# Altium project 1438-5100-Puit de courant.PrjPcb
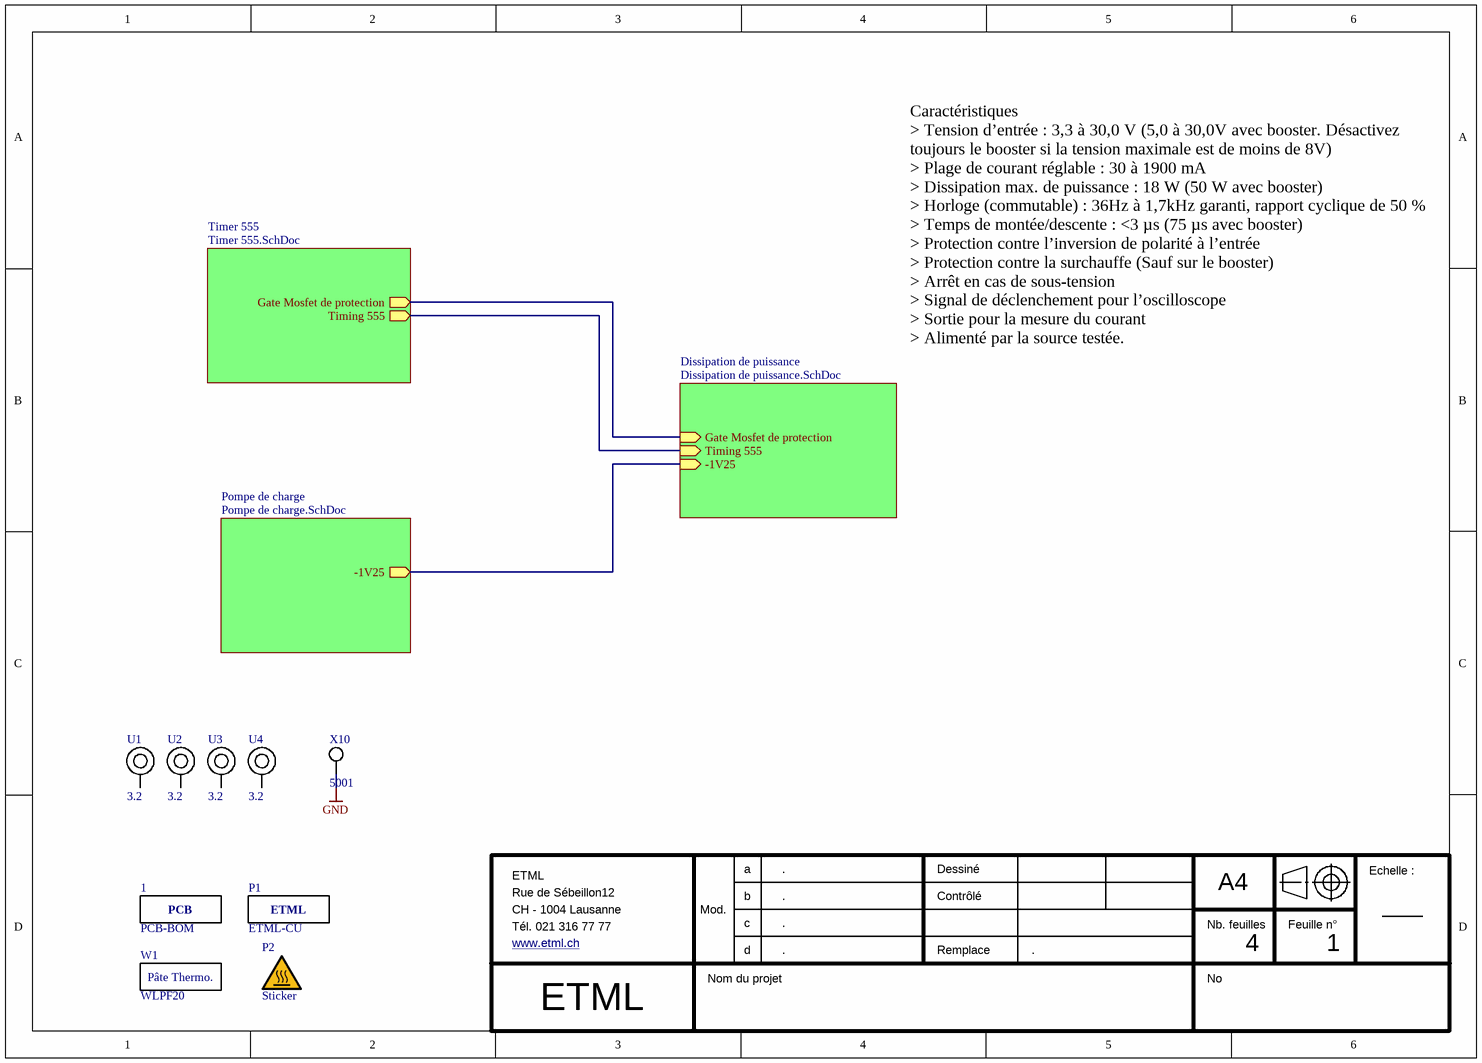
[diagram p0: Schéma bloc.SchDoc]
AsyNumber: 1438.5000.00; BomCheckedBy: -; BomCheckedDate: -; BomDrawnBy: AVR; BomDrawnDate: 2024-03-08; BomNumber: 1438.5600.00; BomTitle: Puit de courant; PcbCheckedBy: -; PcbCheckedDate: -; PcbDrawnBy: AVR; PcbDrawnDate: 2024-03-25; PcbNumber: 1438.5100.00; PcbTitle: Puit de courant; SchCheckedBy: -; SchCheckedDate: -; SchDrawnBy: AVR; SchDrawnDate: 2024-03-08; SchNumber: 1438.5200.00; SchTitle: Puit de courant
4 sheets, 101 parts. Net scope: hierarchical (ports join the sheet entries above them; power ports are global).
Board file: ETML_A4_2L.PcbDoc
Sheets:
  Schéma bloc.SchDoc
    Timer 555 = Timer 555.SchDoc
    Dissipation de puissance = Dissipation de puissance.SchDoc
    Pompe de charge = Pompe de charge.SchDoc

## Sheet Schéma bloc.SchDoc: =SchTitle
size 276 x 198 mm; Date: 2024-03-08; CheckedBy: -; DrawnBy: AVR; Organization: ETML; Address1: Rue de Sébeillon12; Address2: CH - 1004 Lausanne; Address3: Tél. 021 316 77 77; Address4: www.etml.ch; DocumentNumber: 1438.5200.00; SheetNumber: 1; SheetTotal: 4; CheckingDate: -; Replace: .; ModA: .; ModB: .; ModC: .; ModD: .

### Parts
1  PCB-BOM  (mechanical)
P1  ETML-CU  [DRAW-ETML-CU]  (no BOM)
P2  Sticker  [Sticker surface chaude]
U1  3.2  [MECH-PHD320]  (no BOM)
U2  3.2  [MECH-PHD320]  (no BOM)
U3  3.2  [MECH-PHD320]  (no BOM)
U4  3.2  [MECH-PHD320]  (no BOM)
W1  WLPF20
X10  5001  [Keystone_5001]

### Sub-sheets
Dissipation de puissance = Dissipation de puissance.SchDoc: Gate Mosfet de protection (in), Timing 555 (in), -1V25 (in)
Pompe de charge = Pompe de charge.SchDoc: -1V25 (out)
Timer 555 = Timer 555.SchDoc: Gate Mosfet de protection (out), Timing 555 (out)

### Nets
GND: X10.1(TP)
NetC5_2: sheet Dissipation de puissance/-1V25, sheet Pompe de charge/-1V25
NetK4_3: sheet Timer 555/Timing 555, sheet Dissipation de puissance/Timing 555
NetK5_1: sheet Timer 555/Gate Mosfet de protection, sheet Dissipation de puissance/Gate Mosfet de protection

Not connected (* = marked no-connect by the designer): U1 1(PH); U2 1(PH); U3 1(PH); U4 1(PH)

### Notes on the sheet
- Caractéristiques
  > Tension d’entrée : 3,3 à 30,0 V (5,0 à 30,0V avec booster. Désactivez toujours le booster si la tension maximale est de moins de 8V)
  > Plage de courant réglable : 30 à 1900 mA
  > Dissipation max. de puissance : 18 W (50 W avec booster)
  > Horloge (commutable) : 36Hz à 1,7kHz garanti, rapport cyclique de 50 %
  > Temps de montée/descente : <3 µs (75 µs avec booster)
  > Protection contre l’inversion de polarité à l’entrée
  > Protection contre la surchauffe (Sauf sur le booster)
  > Arrêt en cas de sous-tension
  > Signal de déclenchement pour l’oscilloscope
  > Sortie pour la mesure du courant
  > Alimenté par la source testée.
- a
- Dessiné
- A4
- Echelle :
- Mod.
- b
- c
- d
- Contrôlé
- Remplace
- Nb. feuilles
- Feuille n°
- Nom du projet
- No
- (in symbol CMP-064-000000-1) ETML
- (in symbol CMP-064-000001-1) PCB
- (in symbol Graisse thermique) Pâte Thermo.

### Library data of the parts
1 = CMP-064-000001-1: PCB element for BOM; IsStocked: False; PN: PN-108075; Category: Others; SubCategory: Dessins; Supplier Price 1: 0; Supplier 1: Eurocircuits Sàrl; Value: PCB-BOM; Supplier Part Number 1: -
P1 = CMP-064-000000-1: Logo ETML; PN: PN-439033; IsStocked: False; Value: ETML-CU; SubCategory: Dessins; Category: Others
P2 = Sticker Surface chaude ISO7010: PIC W017-TRI 015-PE-SHEET/1; IsStocked: 1; PN: PIC W017-TRI 015-PE-SHEET/1; Supplier 1: Distrelec; Supplier Part Number 1: 302-20-433; Supplier Price 1: 0.246
U1-U4 = CMP-063-000019-1: Plated Hole  3.2mm; IsStocked: False; PN: PN-781782; SubCategory: Mecaniques; Value: 3.2; Category: Others
W1 = Graisse thermique: Pâte thermoconductrice 0.7W/mK 10ml WLPF20 Fischer elektronik; IsStocked: 1; PN: WLPF20; Supplier 1: ETML; Supplier Part Number 1: MAG 369.123; Supplier Price 1: 12.83
X10 = CMP-054-000003-1: TEST THT MINIATURE BK; Manufacturer: Keystone; PN: PN-688907; IsStocked: True; SubCategory: Testpoints; Supplier 1: ETML; Supplier Price 1: 0.26; Supplier Part Number 1: MAG.428.011; Category: Connectors; Manufacturer Number: 5001; Value: 5001

## Sheet Timer 555.SchDoc: =SchTitle
size 276 x 198 mm; Date: 2024-03-08; CheckedBy: -; DrawnBy: AVR; Organization: ETML; Address1: Rue de Sébeillon12; Address2: CH - 1004 Lausanne; Address3: Tél. 021 316 77 77; Address4: www.etml.ch; DocumentNumber: 1438.5200.00; SheetNumber: 3; SheetTotal: 4; CheckingDate: -; Replace: .; ModA: .; ModB: .; ModC: .; ModD: .
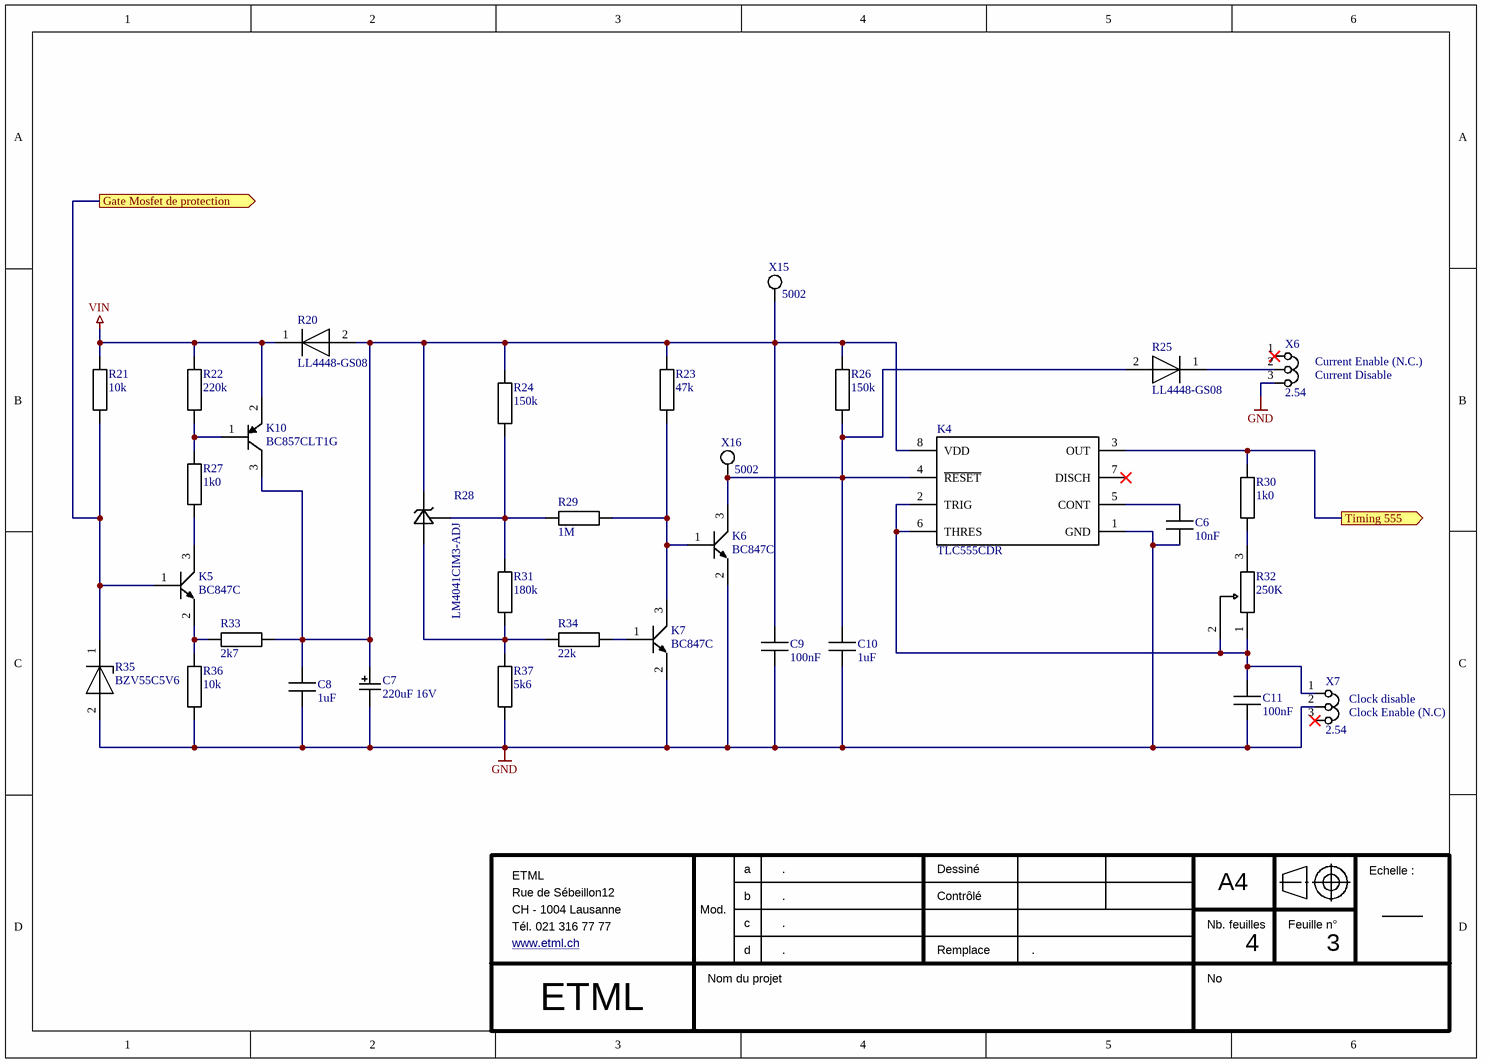
[diagram p1: Timer 555.SchDoc]

### Parts
C6  10nF  [CAPC1608X08M]
C7  220uF 16V  [NIC-CAPA2-6.3X7.7_V]
C8  1uF  [CAPC2012X08M]
C9  100nF  [CAPC2012X08M]
C10  1uF  [CAPC2012X08M]
C11  100nF  [CAPC2012X08M]
K4  TLC555CDR  [FP-D0008A-IPC_B]
K5  BC847C  [SOT90P240X110-3M]
K6  BC847C  [SOT90P240X110-3M]
K7  BC847C  [SOT90P240X110-3M]
K10  BC857CLT1G  [ONSC-SOT-23-3-318-08_V]
R20  LL4448-GS08  [FP-6_560-5005_01-4-MFG]
R21  10k  [RESC2012X06M]
R22  220k  [RESC2012X06M]
R23  47k  [RESC2012X06M]
R24  150k  [RESC2012X06M]
R25  LL4448-GS08  [FP-6_560-5005_01-4-MFG]
R26  150k  [RESC2012X06M]
R27  1k0  [RESC2012X06M]
R28  LM4041CIM3-ADJ  [DBZ0003A_M]
R29  1M  [RESC2012X06M]
R30  1k0  [RESC2012X06M]
R31  180k  [RESC2012X06M]
R32  250K  [FP-3296W-MFG]
R33  2k7  [RESC2012X06M]
R34  22k  [RESC2012X06M]
R35  BZV55C5V6  [FP-DO-213AA-MFG]
R36  10k  [RESC2012X06M]
R37  5k6  [RESC2012X06M]
X6  2.54  [PIN-1x03-2.54]
X7  2.54  [PIN-1x03-2.54]
X15  5002  [Keystone_5002]
X16  5002  [Keystone_5002]

### Ports
Gate Mosfet de protection (out), Timing 555 (out)

### Nets
GND: C6.1 C7.2 C8.1 C9.1 C10.1 C11.1 K4.1(GND) K6.2(Collector) K7.2(Collector) R35.2(A) R36.1 R37.1 X6.3 X7.2
VIN: K10.2(E) R20.1(C) R21.2 R22.2
NetC6_2: C6.2 K4.5(CONT)
NetC7_1: C7.1 C8.2 C9.2 K4.8(VDD) K10.3(C) R20.2(A) R23.2 R24.2 R26.2 R28.2(+V) R33.2 X15.1(TP)
NetC10_2: C10.2 K4.4(~{RESET}) K6.3(Emitter) R25.2(A) R26.1 X16.1(TP)
NetC11_2: C11.2 K4.2(TRIG) K4.6(THRES) R32.1(CCW) R32.2(WIPER) X7.1
NetK4_3: K4.3(OUT) R30.2 ; port Timing 555
NetK5_1: K5.1(Base) R21.1 R35.1(C) ; port Gate Mosfet de protection
NetK5_2: K5.2(Collector) R33.1 R36.2
NetK5_3: K5.3(Emitter) R27.1
NetK6_1: K6.1(Base) K7.3(Emitter) R23.1 R29.1
NetK7_1: K7.1(Base) R34.2
NetK10_1: K10.1(B) R22.1 R27.2
NetR24_1: R24.1 R28.1(FB) R29.2 R31.2
NetR25_1: R25.1(C) X6.2
NetR28_3: R28.3(-V) R31.1 R34.1 R37.2
NetR30_1: R30.1 R32.3(CW)

Not connected (* = marked no-connect by the designer): K4 7(DISCH)*; X6 1(0)*; X7 3*

### Notes on the sheet
- (near X6) Current Enable (N.C.)
- (near X6) Current Disable
- (near X7) Clock disable
- (near X7) Clock Enable (N.C)
- a
- Dessiné
- A4
- Echelle :
- Mod.
- b
- c
- d
- Contrôlé
- Remplace
- Nb. feuilles
- Feuille n°
- Nom du projet
- No

### Library data of the parts
C6 = CMP-065-000010-2: CAPC 10nF X7R 50V 10% 1608 (0603 INCH); Manufacturer: TDK; Manufacturer Number: C1608X7R1H103K080AA; TemperatureRange: -55°C to +125°C; IsStocked: 1; PN: PN-514948; Category: Passives; Voltage: 50V; Supplier 1: ETML; Supplier Part Number 1: FAB.0603_C 10nF; Tolerance: ±10%; SubCategory: Condensateurs ceramique; Dielectric: X7R; Supplier Price 1: 0.0123; Value: 10nF
C7 = CMP-0687-00060-1: Aluminum Electrolytic Capacitor,  220 uF, 16 V, + / - 20%,  6.3 x 7.7 mm D x L; PartNumber: UUD1C221MCL1GS; Manufacturer: Nichicon; Impedance: 0.34 Ohm; Tolerance Rated Capacitance: -20 to 20%; Endurance Time: 2000 h; Rated Ripple Current (at 100kHz): 280 mA; Packing: Dia382mm Reel; IsStocked: 1; PackageReference: CAPAE-D6.3H7.7; DatasheetVersion: 08/2012; Rated Voltage: 16 V; Rated Capacitance: 220 uF; ComponentLink1URL: http://www.nichicon.co.jp/; ComponentLink3URL: http://products.nichicon.co.jp/en/pdf/XJA043/e-ud.pdf; PackageDescription: 2-Pin Surface Mount Device, Diameter 6.3 mm, Height 7.7 mm, Pitch 5.4 mm; ComponentLink3Description: Package Specification; Length: 7.7 mm; RoHS: TRUE; Mounting Technology: Surface Mount; ComponentLink2Description: Datasheet; ComponentLink2URL: http://products.nichicon.co.jp/en/pdf/XJA043/e-ud.pdf; Diameter: 6.3 mm; ComponentLink1Description: Manufacturer URL; PN: UUD1C221MCL1GS; Supplier 1: Mouser; Supplier Part Number 1: 647-UUD1C221MCL; Supplier Price 1: 0.354
C8 C10 = CMP-065-000041-2: CAPC 1uF X5R 25V 10% 2012 (0805 INCH); Manufacturer: TDK; Manufacturer Number: KGM21AR51E105KU; Value: 1µF; TemperatureRange: -55°C to +85°C; IsStocked: 1; Supplier 1: Mouser; Category: Passives; Supplier Part Number 1: 581-KGM21AR51E105KU; SubCategory: Condensateurs ceramique; Tolerance: ±10%; Supplier Price 1: 1; Dielectric: X5R; Voltage: 25V; PN: KGM21AR51E105KU
C9 C11 = CMP-065-000038-2: CAPC 100nF X7R 50V 10% 2012 (0805 INCH); Manufacturer Number: C2012X7R1H104K085AA; Manufacturer: TDK; IsStocked: 1; TemperatureRange: -55°C to +125°C; PN: KAM21AR81H104KU; Supplier Part Number 1: 581-KAM21AR81H104KU; Supplier Price 1: 0.259; Voltage: 50V; Dielectric: X7R; Value: 100nF; SubCategory: Condensateurs ceramique; Category: Passives; Tolerance: ±10%; Supplier 1: Mouser
K4 = CMP-04857-000001-1: IC OSC SGL TIMER 2.1MHZ 8-SOIC; Min Supply Voltage: 2V; Number of Channels: 1; Max Power Dissipation: 725mW; Max Supply Voltage: 15V; Low Level Output Current: 100mA; Current Rating: 250A; Quiescent Current: 250uA; Operating Supply Current: 360uA; High Level Output Current: -10mA; Width: 3.91mm; Case/Package: SOIC; Weight: 0.002561oz; Frequency: 2.1MHz; Height: 1.58mm; Package Quantity: 2500; REACH SVHC: No SVHC; Number of Timers/Counters: 1; Lead Free: Lead Free; Number of Pins: 8; Max Operating Temperature: 125°C; Min Operating Temperature: -40°C; Length: 4.9mm; Radiation Hardening: No; Packaging: Tape and Reel; Termination: SMD/SMT; Mount: Surface Mount; Power Dissipation: 725mW; PN: TLC555CDR; Supplier 1: Mouser; Supplier Part Number 1: 595-TLC555CDR; Supplier Price 1: 0.553; IsStocked: 1
K5-K7 = BC847C: NPN general purpose transistor; IsStocked: 1; PN: BC847C; Supplier 1: Mouser; Supplier Part Number 1: 637-BC847C; Supplier Price 1: 0.086
K10 = CMP-1048-00802-1: General Purpose Transistor, PNP Silicon, 3-Pin SOT-23, Pb-Free, Tape and Reel, BC857CLT1G; Manufacturer: On Semiconductor; IC Continuous (A): -0.1; fT Min (MHz): 100; IsStocked: 1; Polarity: PNP; PackageReference: SOT-23-3-318-08; ComponentLink3Description: Package Specification; ComponentLink2Description: Datasheet; PackageDescription: 3-Pin Small Outline Transistor, Body 2.92 x 1.3 mm, Pitch 0.95 mm; PackageVersion: Rev. AP, 11/2009; ComponentLink1Description: Manufacturer URL; PartNumber: BC857CLT1G; ComponentLink2URL: http://www.onsemi.cn/pub_link/Collateral/BC856ALT1-D.PDF; ComponentLink1URL: http://www.onsemi.com/; ComponentLink3URL: http://www.onsemi.cn/pub_link/Collateral/318-08.PDF; RoHS: TRUE; Packing: Tape and Reel; Mounting Technology: Surface Mount; DatasheetVersion: Rev. 13; PN: BC857CLT1G; Supplier Part Number 1: 863-BC857CLT1G; Supplier 1: Mouser; Supplier Price 1: 0.086
R20 R25 = CMP-249167-000001-1: DIODE GEN PURP 75V 150MA SOD80; Manufacturer: Vishay Small Signal; Max Junction Temp: +175°C; Automotive Grade: Grade 0; Capacitance: 4pF; Peak Reverse Current: 5uA; Forward Current: 300mA; Max Repetitive Reverse Voltage: 100V; Max Surge Forward Current: 2A; Value: 4pF; IsStocked: 1; ComponentLink2Description: Datasheet; Height: 1.6mm; ComponentLink2URL: http://www.vishay.com/docs/85557/ll4148.pdf; Category: Diode; Lead Free: Yes; Device Class L3: Rectifier Diodes; Reverse Voltage: 75V; Mouser Description: Diodes - General Purpose, Power, Switching 100 Volt 100mA; RoHS: TRUE; Temperature: to +175°C; Automotive: Yes; Octopart: https://octopart.com/ll4448-gs08-vishay+small+signal-40886; Digikey Description: DIODE GEN PURP 75V 150MA SOD80; Manufacturer Part Number: LL4448-GS08; Temperature Range High: +175°C; Device Class L1: Discrete Semiconductors; Device Class L2: Diodes; Package: 6.560-5005.01-4; PN: LL4448-GS08; Supplier 1: Mouser; Supplier Part Number 1: 78-LL4448; Supplier Price 1: 0.139
R21 R36 = CMP-066-000199-2: RES 10kohm  ±1% 0.125W 2012 (0805 INCH); Manufacturer Number: RC0805FR-0710KL; Manufacturer: Yageo; PN: PN-374909; TemperatureCoeff: ±200ppm/°C; Voltage: 150V; TemperatureRange: -55°C to 155°C; IsStocked: 1; Tolerance: ±1%; Category: Passives; Value: 10k; Supplier Price 1: 0.0200; Supplier Part Number 1: FAB.0805_R 10k; Supplier 1: ETML; SubCategory: Resistances couche epaisse; Power: 0.125W
R22 = CMP-066-000215-2: RES 220kohm  ±1% 0.125W 2012 (0805 INCH); Manufacturer Number: RC0805FR-07220KL; Manufacturer: Yageo; PN: PN-479575; IsStocked: 1; TemperatureCoeff: ±200ppm/°C; Voltage: 150V; TemperatureRange: -55°C to 155°C; Value: 220k; Power: 0.125W; Tolerance: ±1%; Supplier Price 1: 0.0200; SubCategory: Resistances couche epaisse; Supplier 1: ETML; Category: Passives; Supplier Part Number 1: FAB.0805_R 220k
R23 = CMP-066-000207-2: RES 47kohm  ±1% 0.125W 2012 (0805 INCH); Manufacturer Number: RC0805FR-0747KL; Manufacturer: Yageo; TemperatureRange: -55°C to 155°C; Voltage: 150V; IsStocked: 1; TemperatureCoeff: ±200ppm/°C; PN: PN-427242; Category: Passives; Supplier Price 1: 0.0200; Power: 0.125W; Supplier 1: ETML; Tolerance: ±1%; SubCategory: Resistances couche epaisse; Supplier Part Number 1: FAB.0805_R 47k; Value: 47k
R24 R26 = CMP-066-000213-2: RES 150kohm  ±1% 0.125W 2012 (0805 INCH); Manufacturer: Yageo; Manufacturer Number: RC0805FR-07150KL; Voltage: 150V; TemperatureRange: -55°C to 155°C; TemperatureCoeff: ±200ppm/°C; PN: PN-241492; IsStocked: 1; Tolerance: ±1%; Supplier Part Number 1: FAB.0805_R 150k; Power: 0.125W; Value: 150k; Supplier Price 1: 0.0200; Category: Passives; Supplier 1: ETML; SubCategory: Resistances couche epaisse
R27 R30 = CMP-066-000187-2: RES 1.0kohm  ±1% 0.125W 2012 (0805 INCH); Manufacturer: Yageo; Manufacturer Number: RC0805FR-071KL; Value: 1k; PN: PN-746409; TemperatureRange: -55°C to 155°C; IsStocked: 1; TemperatureCoeff: ±200ppm/°C; Voltage: 150V; Supplier 1: ETML; SubCategory: Resistances couche epaisse; Supplier Price 1: 0.0200; Supplier Part Number 1: FAB.0805_R 1k0; Category: Passives; Tolerance: ±1%; Power: 0.125W
R28 = CMP-0074-00726-3: Precision Micropower Shunt Voltage Reference, 3-pin SOT-23; Manufacturer: Texas Instruments; PowerWise: N; PackageTopMarking: RAC*XTT; CompType: Voltage Reference IC; PN: LM4041CIM3-ADJ/NOPB; IsStocked: 1; DatasheetVersion: Mar-2005; PackageDescription: Molded SOT-23, .115 x .051 x .037in Body, 3 Lead, .075 in Pitch; PackageReference: DBZ0003A; PinCount: 3; PackageVersion: revB, Mar-2003; ComponentLink1URL: http://www.ti.com/general/docs/lit/getliterature.tsp?genericPartNumber=LM4041-N&fileType=pdf; RevisionNote: Component URLs added; RoHS: N; ComponentLink1Description: Datasheet URL; Supplier 1: Mouser; Supplier Part Number 1: 926-M4041CIM3ADJNOPB; Supplier Price 1: 0.623
R29 = CMP-066-000223-2: RES 1.0Mohm  ±1% 0.125W 2012 (0805 INCH); Manufacturer: Yageo; Manufacturer Number: RC0805FR-071ML; IsStocked: 1; Voltage: 150V; TemperatureCoeff: ±200ppm/°C; TemperatureRange: -55°C to 155°C; PN: PN-531908; Tolerance: ±1%; Supplier Price 1: 0.0200; Power: 0.125W; Supplier 1: ETML; Category: Passives; Supplier Part Number 1: FAB.0805_R 1M; SubCategory: Resistances couche epaisse; Value: 1M
R31 = CMP-066-000214-2: RES 180kohm  ±1% 0.125W 2012 (0805 INCH); Manufacturer: Yageo; Manufacturer Number: RC0805FR-07180KL; TemperatureCoeff: ±200ppm/°C; Voltage: 150V; TemperatureRange: -55°C to 155°C; PN: PN-810533; IsStocked: 1; SubCategory: Resistances couche epaisse; Power: 0.125W; Supplier 1: ETML; Value: 180k; Supplier Part Number 1: FAB.0805_R 180k; Tolerance: ±1%; Supplier Price 1: 0.0200; Category: Passives
R32 = CMP-07234-000001-1: TRIMMER 250K OHM 0.5W PC PIN TOP; Manufacturer: Bourns; Manufacturer Part Number: 3296W-1-254LF; Value: 250kΩ; Standoff Height: 0.38mm; Temperature Coefficient: 100ppm/°C; Tolerance: 10%; Voltage Rating: 300V; IsStocked: 1; Category: Res; Octopart: https://octopart.com/3296w-1-254lf-bourns-574856; Device Class L2: Resistors; Mouser Description: Res Cermet Trimmer 250K Ohm 10% 1/2W 25(Elec)Turn 2.19mm (9.53 X 4.83 X 11.55mm) Pin Thru-Hole Tube; Temperature: -55°C to +125°C; Temperature Range Low: -55°C; ComponentLink2URL: https://www.bourns.com/data/global/pdfs/3296.pdf; Power Rating: 0.5W; Package: 3296W; Lead Free: Yes; Series: Trimpot 3296-Sealed; Height: 12.05mm; Device Class L1: Passive Components; Device Class L3: Variable Resistors and Potentiometers; ComponentLink2Description: Datasheet; Resistance: 250kΩ; Digikey Description: TRIMMER 250K OHM 0.5W PC PIN TOP; Automotive: No; RoHS: TRUE; Temperature Range High: +125°C; PN: 3296W-1-254LF; Supplier 1: Mouser; Supplier Part Number 1: 652-3296W-1-254LF; Supplier Price 1: 2.12
R33 = CMP-066-000192-2: RES 2.7kohm  ±1% 0.125W 2012 (0805 INCH); Manufacturer Number: RC0805FR-072K7L; Manufacturer: Yageo; Value: 2.7k; TemperatureRange: -55°C to 155°C; TemperatureCoeff: ±200ppm/°C; IsStocked: 1; PN: PN-891617; Voltage: 150V; Category: Passives; Supplier 1: ETML; SubCategory: Resistances couche epaisse; Supplier Part Number 1: FAB.0805_R 2k7; Power: 0.125W; Tolerance: ±1%; Supplier Price 1: 0.0200
R34 = CMP-066-000203-2: RES 22kohm  ±1% 0.125W 2012 (0805 INCH); Manufacturer: Yageo; Manufacturer Number: RC0805FR-0722KL; PN: PN-851075; Voltage: 150V; TemperatureCoeff: ±200ppm/°C; TemperatureRange: -55°C to 155°C; IsStocked: 1; Tolerance: ±1%; Supplier Part Number 1: FAB.0805_R 22k; SubCategory: Resistances couche epaisse; Value: 22k; Supplier Price 1: 0.0200; Supplier 1: ETML; Category: Passives; Power: 0.125W
R35 = CMP-00252-16640727-1: BZV55C5V6 Diode Zener Single 5.6V 2% 3.33mW 2-Pin MELF DO-213AA Bag; Test Current: 5mA; Voltage Tolerance: 7%; Min Operating Temperature: -65°C; RoHS: Non-Compliant; Element Configuration: Single; Number of Pins: 2; NexarPartId: 16640727; Zener Voltage: 5.6V; Lifecycle Status: Production; Mount: Surface Mount; Tolerance: 7%; Max Operating Temperature: 175°C; PN: BZV55C5V6; Supplier 1: Mouser; Supplier Part Number 1: 494-BZV55C5V6; Supplier Price 1: 2.53
R37 = CMP-066-000196-2: RES 5.6kohm  ±1% 0.125W 2012 (0805 INCH); Manufacturer: Yageo; Manufacturer Number: RC0805FR-075K6L; IsStocked: 1; PN: PN-467784; TemperatureRange: -55°C to 155°C; Value: 5.6k; Voltage: 150V; TemperatureCoeff: ±200ppm/°C; Power: 0.125W; Supplier Part Number 1: FAB.0805_R 5k6; Tolerance: ±1%; Supplier Price 1: 0.0200; Supplier 1: ETML; Category: Passives; SubCategory: Resistances couche epaisse
X6 X7 = CMP-054-000017-1: JUMPER 2.54 1x03; Manufacturer Number: 61303611121; Manufacturer: Würth Electronik; Current: 3A; IsStocked: True; PN: PN-771444; Voltage: 250VAC; TemperatureRange: -40°C to +105 °C; Supplier 1: ETML; Supplier Price 1: 0.06; Category: Connectors; SubCategory: Jumpers; Supplier Part Number 1: MAG.283.897; Value: 2.54
X15 X16 = CMP-054-000004-1: TEST THT MINIATURE WT; Manufacturer: Keystone; PN: PN-357949; IsStocked: True; Category: Connectors; Value: 5002; Supplier Part Number 1: MAG.428.013; Supplier 1: ETML; Supplier Price 1: 0.2931; SubCategory: Testpoints; Manufacturer Number: 5002

## Sheet Dissipation de puissance.SchDoc: =SchTitle
size 276 x 198 mm; Date: 2024-03-08; CheckedBy: -; DrawnBy: AVR; Organization: ETML; Address1: Rue de Sébeillon12; Address2: CH - 1004 Lausanne; Address3: Tél. 021 316 77 77; Address4: www.etml.ch; DocumentNumber: 1438.5200.00; SheetNumber: 2; SheetTotal: 4; CheckingDate: -; Replace: .; ModA: .; ModB: .; ModC: .; ModD: .
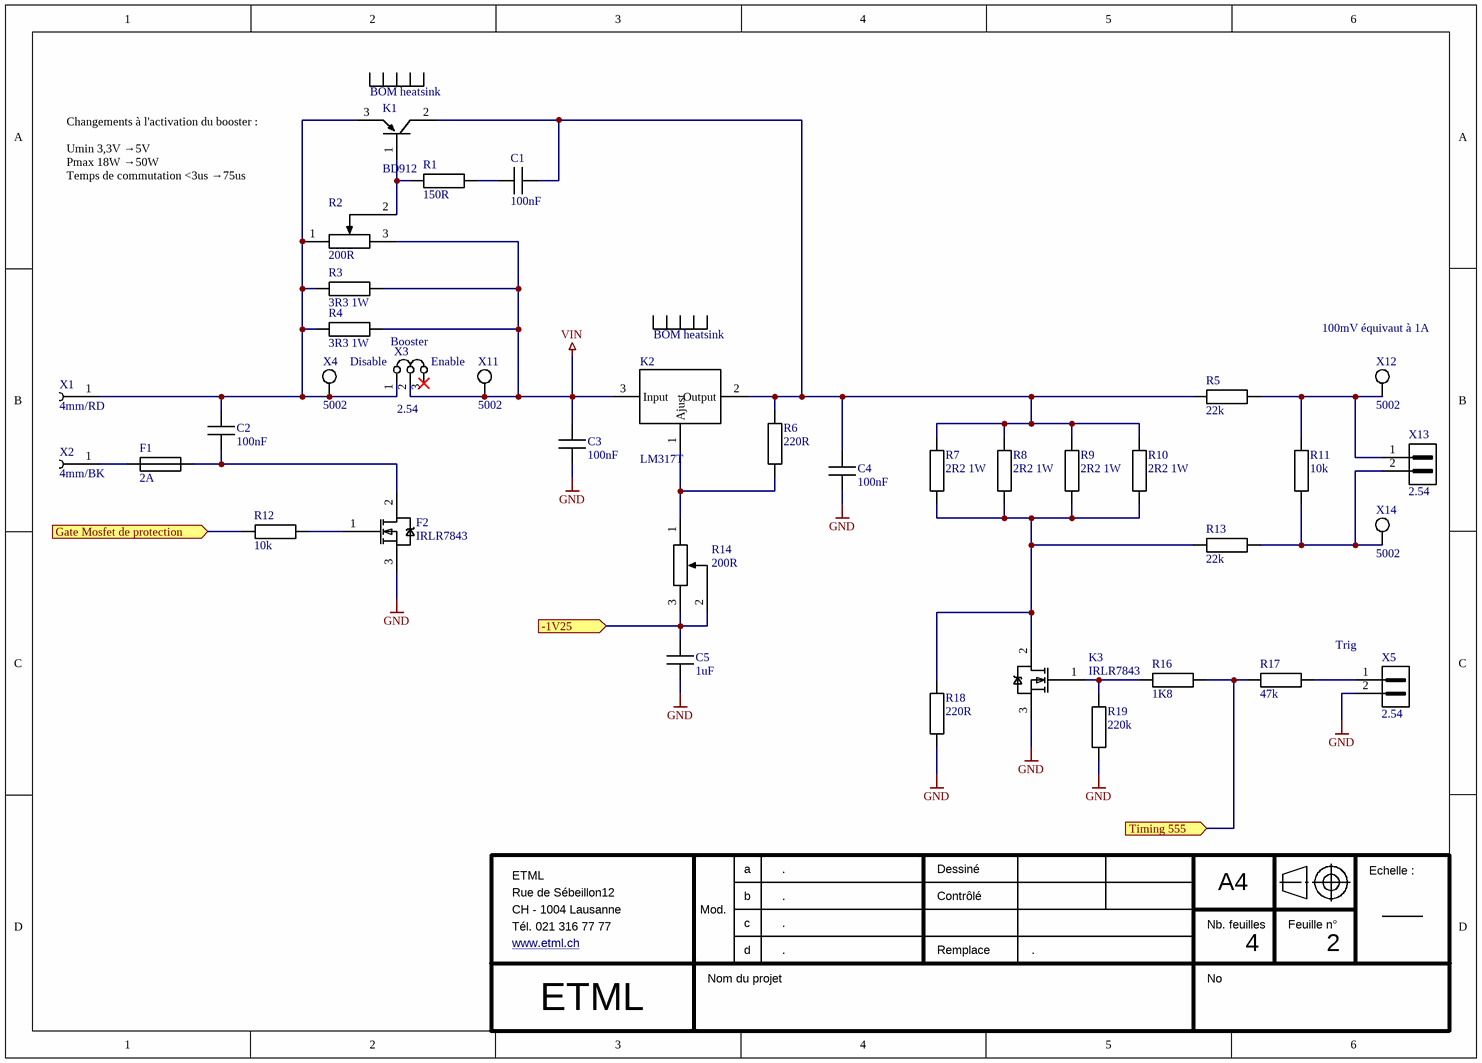
[diagram p2: Dissipation de puissance.SchDoc]

### Parts
C1  100nF  [CAPC2012X08M]
C2  100nF  [CAPC2012X08M]
C3  100nF  [CAPC2012X08M]
C4  100nF  [CAPC2012X08M]
C5  1uF  [CAPC2012X08M]
E1  WAKEFIELD THERMAL 678-39-C  [Designator]  (value not drawn)
E2  WAKEFIELD THERMAL 678-39-C  [Designator]  (value not drawn)
F1  2A  [WE_696103201002]
F2  IRLR7843  [DPAK228P991X238-3M]
K1  BD912  [TO220 With WAKEFIELD THERMAL 678-39-C]
K2  LM317T  [TO220 With WAKEFIELD THERMAL 678-39-C]
K3  IRLR7843  [DPAK228P991X238-3M]
R1  150R  [RESC2012X06M]
R2  200R  [FP-3296W-MFG]
R3  3R3 1W  [NEOHM 1W ROX1S]
R4  3R3 1W  [NEOHM 1W ROX1S]
R5  22k  [RESC2012X06M]
R6  220R  [RESC2012X06M]
R7  2R2 1W  [NEOHM 1W ROX1S]
R8  2R2 1W  [NEOHM 1W ROX1S]
R9  2R2 1W  [NEOHM 1W ROX1S]
R10  2R2 1W  [NEOHM 1W ROX1S]
R11  10k  [RESC2012X06M]
R12  10k  [RESC2012X06M]
R13  22k  [RESC2012X06M]
R14  200R  [FP-3296W-MFG]
R16  1K8  [RESC2012X06M]
R17  47k  [RESC2012X06M]
R18  220R  [RESC2012X06M]
R19  220k  [RESC2012X06M]
X1  4mm/RD  [SKS_973582101]
X2  4mm/BK  [SKS_973582100]
X3  2.54  [PIN-1x03-2.54]
X4  5002  [Keystone_5002]
X5  2.54  [PIN-1x02-2.54]
X11  5002  [Keystone_5002]
X12  5002  [Keystone_5002]
X13  2.54  [PIN-1x02-2.54]
X14  5002  [Keystone_5002]

### Ports
-1V25 (in), Gate Mosfet de protection (in), Timing 555 (in)

### Nets
GND: C3.1 C4.1 C5.1 F2.3(S) K3.3(S) R18.1 R19.1 X5.2
VIN: C3.2 K2.3(Input) R2.3 R3.2 R4.2 X3.2 X11.1(TP)
NetC1_1: C1.1 C4.2 K1.2(Collector) K2.2(Output) R5.1 R6.2 R7.2 R8.2 R9.2 R10.2
NetC1_2: C1.2 R1.2
NetC2_1: C2.1 F1.2 F2.2(D)
NetC2_2: C2.2 K1.3(Emitter) R2.1 R3.1 R4.1 X1.1 X3.1 X4.1(TP)
NetC5_2: C5.2 R14.2 R14.3 ; port -1V25
NetF1_1: F1.1 X2.1
NetF2_1: F2.1(G) R12.2
NetK1_1: K1.1(Base) R1.1 R2.2
NetK2_1: K2.1(Ajust) R6.1 R14.1
NetK3_1: K3.1(G) R16.1 R19.2
NetK3_2: K3.2(D) R7.1 R8.1 R9.1 R10.1 R13.1 R18.2
NetK4_3: R16.2 R17.1 ; port Timing 555
NetK5_1: R12.1 ; port Gate Mosfet de protection
NetR5_2: R5.2 R11.2 X12.1(TP) X13.1
NetR11_1: R11.1 R13.2 X13.2 X14.1(TP)
NetR17_2: R17.2 X5.1

Not connected (* = marked no-connect by the designer): X3 3*

### Notes on the sheet
- Changements à l'activation du booster :
  Umin 3,3V →5V
  Pmax 18W →50W
  Temps de commutation <3us →75us
- (near X12) 100mV équivaut à 1A
- (near X3) Disable
- Booster
- (near X3) Enable
- Trig
- a
- Dessiné
- A4
- Echelle :
- Mod.
- b
- c
- d
- Contrôlé
- Remplace
- Nb. feuilles
- Feuille n°
- Nom du projet
- No
- (in symbol WAKEFIELD THERMAL 678-39-C) BOM heatsink

### Library data of the parts
C1-C4 = CMP-065-000038-2: as C9 on sheet Timer 555; Supplier Part Number 1: 581-KAM21AR81H104KU; Supplier Price 1: 0.259; Voltage: 50V; Dielectric: X7R; Value: 100nF; SubCategory: Condensateurs ceramique; Category: Passives; Tolerance: ±10%; Supplier 1: Mouser
C5 = CMP-065-000041-2: as C8 on sheet Timer 555; Supplier 1: Mouser; Category: Passives; Supplier Part Number 1: 581-KGM21AR51E105KU; SubCategory: Condensateurs ceramique; Tolerance: ±10%; Supplier Price 1: 1; Dielectric: X5R; Voltage: 25V; PN: KGM21AR51E105KU
E1 E2 = WAKEFIELD THERMAL 678-39-C: HEAT SINK, ALUMINIUM, TO-PACKAGE, SMD
F1 = CMP-067-000003-1: Fusible FST 2A temporisé; Manufacturer: Würth Electronik; Manufacturer Number: 696103201002; TemperatureRange: -30°C to +120°C; Voltage: 250VAC; PN: 261.476; Value: 5x20mm; IsStocked: True; Supplier Part Number 1: MAG 261.476; Current: 2A; SubCategory: Fusibles; Category: Protections; Supplier 1: ETML; Supplier Price 1: 0.33
F2 K3 = IRLR7843: N channel Mosfet
K1 = BD912: PNP transistor
K2 = LM317T: TO-220 ajustable votage regulator
R1 = CMP-066-000177-2: RES 150ohm  ±1% 0.125W 2012 (0805 INCH); Manufacturer: Yageo; Manufacturer Number: RC0805FR-07150RL; Value: 150; TemperatureRange: -55°C to 155°C; Voltage: 150V; TemperatureCoeff: ±200ppm/°C; PN: PN-455993; IsStocked: 1; Supplier Price 1: 0.0200; Tolerance: ±1%; SubCategory: Resistances couche epaisse; Power: 0.125W; Supplier Part Number 1: FAB.0805_R 150R; Supplier 1: ETML; Category: Passives
R2 R14 = CMP-066-000235-2: RESADJ 200ohm Cermet 25 turns; Manufacturer: Bourns Incorporated; Tolerance: ±10%; TemperatureCoeff: ±100ppm/°C; IsStocked: 1; PN: PN-614445; Power: 500mW; TemperatureRange: -55°C to +125°C; Supplier 1: Farnell; Category: Passives; Supplier Price 1: 3.36; Value: 200R; Supplier Part Number 1: 9353747; SubCategory: Resistances ajustables
R3 R4 = NEOHM - TE CONNECTIVITY ROX1SJ3R3: Résistance traversante, 3.3 ohm, ROX, 1 W, ± 5%, Axial, 350 V; Manufacturer Number: MRS25000C3308FCT00; Manufacturer: Vishay; PN: PN-918915; Voltage: 350V; Power: 0.6W; TemperatureRange: -55°C to 155°C; Value: 3.3; Tolerance: ±1%; IsStocked: 1; TemperatureCoeff: ±50ppm/°C; Supplier Price 1: 0.1500; SubCategory: Resistances film metallique; Category: Passives; Supplier 1: Farnell; Supplier 2: Mouser; Supplier 3: Digikey; Supplier Part Number 1: 3399704; Supplier Part Number 2: 279-ROX1SJ3R3; Supplier Part Number 3: A131468CT-ND
R5 R13 = CMP-066-000203-2: as R34 on sheet Timer 555; Tolerance: ±1%; Supplier Part Number 1: FAB.0805_R 22k; SubCategory: Resistances couche epaisse; Value: 22k; Supplier Price 1: 0.0200; Supplier 1: ETML; Category: Passives; Power: 0.125W
R6 R18 = CMP-066-000179-2: RES 220ohm  ±1% 0.125W 2012 (0805 INCH); Manufacturer: Yageo; Manufacturer Number: RC0805FR-07220RL; TemperatureRange: -55°C to 155°C; Voltage: 150V; IsStocked: 1; TemperatureCoeff: ±200ppm/°C; PN: PN-694076; Value: 220; SubCategory: Resistances couche epaisse; Supplier Price 1: 0.0200; Category: Passives; Supplier Part Number 1: FAB.0805_R 220R; Supplier 1: ETML; Tolerance: ±1%; Power: 0.125W
R7-R10 = NEOHM - TE CONNECTIVITY ROX1SJ2R2: Résistance traversante, 2.2 ohm, ROX, 1 W, ± 5%, Axial, 350 V; Manufacturer Number: MRS25000C3308FCT00; Manufacturer: Vishay; PN: PN-918915; Voltage: 350V; Power: 0.6W; TemperatureRange: -55°C to 155°C; Value: 2.2; Tolerance: ±1%; IsStocked: 1; TemperatureCoeff: ±50ppm/°C; Supplier Price 1: 0.1500; SubCategory: Resistances film metallique; Category: Passives; Supplier 1: Farnell; Supplier 2: Mouser; Supplier 3: Digikey; Supplier Part Number 1: 3399704; Supplier Part Number 2: 279-ROX1SJ3R3; Supplier Part Number 3: A131468CT-ND
R11 R12 = CMP-066-000199-2: as R21 on sheet Timer 555; Tolerance: ±1%; Category: Passives; Value: 10k; Supplier Price 1: 0.0200; Supplier Part Number 1: FAB.0805_R 10k; Supplier 1: ETML; SubCategory: Resistances couche epaisse; Power: 0.125W
R16 = CMP-066-000190-2: RES 1.8kohm  ±1% 0.125W 2012 (0805 INCH); Manufacturer Number: RC0805FR-071K8L; Manufacturer: Yageo; TemperatureRange: -55°C to 155°C; Voltage: 150V; IsStocked: 1; PN: PN-653534; TemperatureCoeff: ±200ppm/°C; Value: 1.8k; Power: 0.125W; Supplier Part Number 1: FAB.0805_R 1K8; Category: Passives; Tolerance: ±1%; Supplier Price 1: 0.0200; Supplier 1: ETML; SubCategory: Resistances couche epaisse
R17 = CMP-066-000207-2: as R23 on sheet Timer 555; Category: Passives; Supplier Price 1: 0.0200; Power: 0.125W; Supplier 1: ETML; Tolerance: ±1%; SubCategory: Resistances couche epaisse; Supplier Part Number 1: FAB.0805_R 47k; Value: 47k
R19 = CMP-066-000215-2: as R22 on sheet Timer 555; Value: 220k; Power: 0.125W; Tolerance: ±1%; Supplier Price 1: 0.0200; SubCategory: Resistances couche epaisse; Supplier 1: ETML; Category: Passives; Supplier Part Number 1: FAB.0805_R 220k
X1 = CMP-054-000001-1: Embase 4mm PCB 16A 60VDC Sn Red; Manufacturer: SKS Kontakttechnik GmbH; Manufacturer Number: 973582101; TemperatureRange: -25°C to +85°C; PN: PN-628499; Dielectric: PC; IsStocked: True; Value: 4mm/RD; Supplier Price 1: 1.7; Supplier 1: ETML; Current: 16A; Voltage: 60VDC; SubCategory: Laboratoire; Category: Connectors; Supplier Part Number 1: MAG.277.666
X2 = CMP-054-000000-1: Embase 4mm PCB 16A 60VDC Sn Black; Manufacturer: SKS Kontakttechnik GmbH; Manufacturer Number: 973582100; Dielectric: PC; TemperatureRange: -25°C to +85°C; IsStocked: True; PN: PN-390416; SubCategory: Laboratoire; Supplier 1: ETML; Supplier Price 1: 1.51; Value: 4mm/BK; Supplier Part Number 1: MAG.277.665; Voltage: 60VDC; Current: 16A; Category: Connectors
X3 = CMP-054-000017-1: as X6 on sheet Timer 555; Supplier 1: ETML; Supplier Price 1: 0.06; Category: Connectors; SubCategory: Jumpers; Supplier Part Number 1: MAG.283.897; Value: 2.54
X4 X11 X12 X14 = CMP-054-000004-1: as X15 on sheet Timer 555; Category: Connectors; Value: 5002; Supplier Part Number 1: MAG.428.013; Supplier 1: ETML; Supplier Price 1: 0.2931; SubCategory: Testpoints; Manufacturer Number: 5002
X5 X13 = CMP-055-000006-1: PIN HEADER 2.54 1x02; Manufacturer Number: 61300211121; Manufacturer: Würth Electronik; IsStocked: True; PN: PN-573903; Voltage: 250V; Current: 3A; TemperatureRange: -40°C to +105°C; Supplier Part Number 1: MAG.283.897; Supplier Price 1: 0.04; Supplier 1: ETML; SubCategory: Pin Header; Category: Connectors; Value: 2.54

## Sheet Pompe de charge.SchDoc: =SchTitle
size 276 x 198 mm; Date: 2024-03-08; CheckedBy: -; DrawnBy: AVR; Organization: ETML; Address1: Rue de Sébeillon12; Address2: CH - 1004 Lausanne; Address3: Tél. 021 316 77 77; Address4: www.etml.ch; DocumentNumber: 1438.5200.00; SheetNumber: 4; SheetTotal: 4; CheckingDate: -; Replace: .; ModA: .; ModB: .; ModC: .; ModD: .
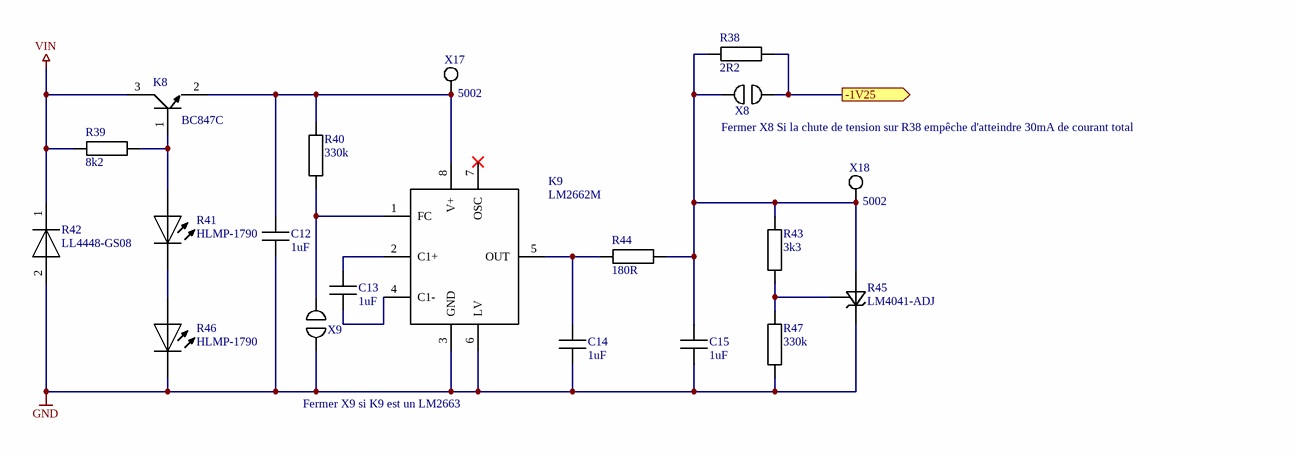
[diagram p3: Pompe de charge.SchDoc]

### Parts
C12  1uF  [CAPC2012X08M]
C13  1uF  [CAPC2012X08M]
C14  1uF  [CAPC2012X08M]
C15  1uF  [CAPC2012X08M]
K8  BC847C  [SOT90P240X110-3M]
K9  LM2662M  [D0008A_M]
R38  2R2  [RESC2012X06M]
R39  8k2  [RESC2012X06M]
R40  330k  [RESC2012X06M]
R41  HLMP-1790  [FP-6_544-5255_01-4-MFG]
R42  LL4448-GS08  [FP-6_560-5005_01-4-MFG]
R43  3k3  [RESC2012X06M]
R44  180R  [RESC2012X06M]
R45  LM4041-ADJ  [SOT90P240X110-3M]
R46  HLMP-1790  [FP-6_544-5255_01-4-MFG]
R47  330k  [RESC2012X06M]
X8  Solder bridge  [Solder brige]  (value not drawn)
X9  Solder bridge  [Solder brige]  (value not drawn)
X17  5002  [Keystone_5002]
X18  5002  [Keystone_5002]

### Ports
-1V25 (out)

### Nets
GND: C12.1 C14.1 C15.1 K9.3(GND) K9.6(LV) R42.2(A) R45.2(+V) R46.K R47.1 X9.1
VIN: K8.3(Emitter) R39.1 R42.1(C)
NetC5_2: R38.2 X8.1 ; port -1V25
NetC12_2: C12.2 K8.2(Collector) K9.8(V+) R40.2 X17.1(TP)
NetC13_1: C13.1 K9.4(C1-)
NetC13_2: C13.2 K9.2(C1+)
NetC14_2: C14.2 K9.5(OUT) R44.1
NetC15_2: C15.2 R38.1 R43.2 R44.2 R45.3(-V) X8.2 X18.1(TP)
NetK8_1: K8.1(Base) R39.2 R41.A
NetK9_1: K9.1(FC) R40.1 X9.2
NetR41_K: R41.K R46.A
NetR43_1: R43.1 R45.1(FB) R47.2

Not connected (* = marked no-connect by the designer): K9 7(OSC)*

### Notes on the sheet
- (near X8) Fermer X8 Si la chute de tension sur R38 empêche d'atteindre 30mA de courant total
- Fermer X9 si K9 est un LM2663
- a
- Dessiné
- A4
- Echelle :
- Mod.
- b
- c
- d
- Contrôlé
- Remplace
- Nb. feuilles
- Feuille n°
- Nom du projet
- No

### Library data of the parts
C12-C15 = CMP-065-000041-2: as C8 on sheet Timer 555; Supplier 1: Mouser; Category: Passives; Supplier Part Number 1: 581-KGM21AR51E105KU; SubCategory: Condensateurs ceramique; Tolerance: ±10%; Supplier Price 1: 1; Dielectric: X5R; Voltage: 25V; PN: KGM21AR51E105KU
K8 = BC847C: NPN general purpose transistor
K9 = LM2662M: Switched Capacitor Voltage Converter, 8-pin Narrow SOIC; Manufacturer: Texas Instruments; PackageTopMarking: NSZXTT*LM26*62M; PowerWise: N; CompType: Switch Caps; IsStocked: 1; PackageDescription: SOIC Narrow, 4.9 x 3.9 x 1.45mm, 8 Lead, 1.27mm Pitch; ComponentLink1URL: http://www.ti.com/general/docs/lit/getliterature.tsp?genericPartNumber=LM2662&fileType=pdf; PackageReference: D0008A; PinCount: 8; Code_JEDEC: MS-012-AA; ComponentLink1Description: Datasheet URL; RoHS: N; Code_IPC: SOIC127P600-8; PN: LM2662M; Supplier 1: Farnell; Supplier Part Number 1: 9306803; Supplier Price 1: 2.51
R38 = CMP-066-000155-2: RES 2.2ohm  ±1% 0.125W 2012 (0805 INCH); Manufacturer Number: RC0805FR-072R2L; Manufacturer: Yageo; TemperatureCoeff: ±200ppm/°C; Voltage: 150V; PN: PN-537077; Value: 2.2; TemperatureRange: -55°C to 155°C; IsStocked: 1; Supplier 1: ETML; Power: 0.125W; Category: Passives; Supplier Part Number 1: FAB.0805_R 2R2; SubCategory: Resistances couche epaisse; Supplier Price 1: 0.0200; Tolerance: ±1%
R39 = CMP-066-000198-2: RES 8.2kohm  ±1% 0.125W 2012 (0805 INCH); Manufacturer: Yageo; Manufacturer Number: RC0805FR-078K2L; TemperatureRange: -55°C to 155°C; TemperatureCoeff: ±200ppm/°C; IsStocked: 1; PN: PN-705867; Voltage: 150V; Value: 8.2k; Supplier Part Number 1: FAB.0805_R 8k2; Supplier Price 1: 0.0200; Supplier 1: ETML; Tolerance: ±1%; Category: Passives; SubCategory: Resistances couche epaisse; Power: 0.125W
R40 R47 = CMP-066-000217-2: RES 330kohm  ±1% 0.125W 2012 (0805 INCH); Manufacturer: Yageo; Manufacturer Number: RC0805FR-07330KL; PN: PN-717658; IsStocked: 1; Voltage: 150V; TemperatureCoeff: ±200ppm/°C; TemperatureRange: -55°C to 155°C; Tolerance: ±1%; Supplier 1: ETML; Power: 0.125W; Value: 330k; SubCategory: Resistances couche epaisse; Category: Passives; Supplier Part Number 1: FAB.0805_R 330k; Supplier Price 1: 0.0200
R41 R46 = HLMP-1790: HLMP-1790 2V 2mA; PN: MAG 355.161; IsStocked: 1; Supplier 1: ETML; Supplier Part Number 1: MAG 355.161; Supplier Price 1: 0.00
R42 = LL4448-GS08: DIODE GEN PURP 75V 150MA SOD80; Manufacturer: Vishay Small Signal; Max Junction Temp: +175°C; Automotive Grade: Grade 0; Capacitance: 4pF; Peak Reverse Current: 5uA; Forward Current: 300mA; Max Repetitive Reverse Voltage: 100V; Max Surge Forward Current: 2A; Value: 4pF; ComponentLink2Description: Datasheet; Height: 1.6mm; ComponentLink2URL: http://www.vishay.com/docs/85557/ll4148.pdf; Category: Diode; Lead Free: Yes; Device Class L3: Rectifier Diodes; Reverse Voltage: 75V; Mouser Description: Diodes - General Purpose, Power, Switching 100 Volt 100mA; RoHS: TRUE; Temperature: to +175°C; Automotive: Yes; Octopart: https://octopart.com/ll4448-gs08-vishay+small+signal-40886; Digikey Description: DIODE GEN PURP 75V 150MA SOD80; Manufacturer Part Number: LL4448-GS08; Temperature Range High: +175°C; Device Class L1: Discrete Semiconductors; Device Class L2: Diodes; Package: 6.560-5005.01-4
R43 = CMP-066-000193-2: RES 3.3kohm  ±1% 0.125W 2012 (0805 INCH); Manufacturer: Yageo; Manufacturer Number: RC0805FR-073K3L; Voltage: 150V; Value: 3.3k; TemperatureRange: -55°C to 155°C; TemperatureCoeff: ±200ppm/°C; IsStocked: 1; PN: PN-560659; SubCategory: Resistances couche epaisse; Supplier 1: ETML; Power: 0.125W; Category: Passives; Tolerance: ±1%; Supplier Part Number 1: FAB.0805_R 3k3; Supplier Price 1: 0.0200
R44 = CMP-066-000178-2: RES 180ohm  ±1% 0.125W 2012 (0805 INCH); Manufacturer: Yageo; Manufacturer Number: RC0805FR-07180RL; Value: 180; TemperatureRange: -55°C to 155°C; TemperatureCoeff: ±200ppm/°C; PN: PN-125035; Voltage: 150V; IsStocked: 1; SubCategory: Resistances couche epaisse; Power: 0.125W; Tolerance: ±1%; Supplier 1: ETML; Supplier Price 1: 0.0200; Supplier Part Number 1: FAB.0805_R 180R; Category: Passives
R45 = LM4041: Precision Micropower Shunt Voltage Reference, 3-pin SOT-23; Manufacturer: Texas Instruments; PowerWise: N; PackageTopMarking: RAC*XTT; CompType: Voltage Reference IC; DatasheetVersion: Mar-2005; PackageDescription: Molded SOT-23, .115 x .051 x .037in Body, 3 Lead, .075 in Pitch; PackageReference: DBZ0003A; PinCount: 3; PackageVersion: revB, Mar-2003; ComponentLink1URL: http://www.ti.com/general/docs/lit/getliterature.tsp?genericPartNumber=LM4041-N&fileType=pdf; RevisionNote: Component URLs added; RoHS: N; ComponentLink1Description: Datasheet URL
X17 X18 = CMP-054-000004-1: as X15 on sheet Timer 555; Category: Connectors; Value: 5002; Supplier Part Number 1: MAG.428.013; Supplier 1: ETML; Supplier Price 1: 0.2931; SubCategory: Testpoints; Manufacturer Number: 5002

## Nets that join several sheets
GND: Schéma bloc (X10.1), Timer 555 (14 pins), Dissipation de puissance (8 pins), Pompe de charge (10 pins)
VIN: Timer 555 (K10.2 R20.1 R21.2 R22.2), Dissipation de puissance (7 pins), Pompe de charge (K8.3 R39.1 R42.1)
NetC5_2: Dissipation de puissance (C5.2 R14.2 R14.3), Pompe de charge (R38.2 X8.1)
NetK4_3: Timer 555 (K4.3 R30.2), Dissipation de puissance (R16.2 R17.1)
NetK5_1: Timer 555 (K5.1 R21.1 R35.1), Dissipation de puissance (R12.1)